# Altium project Smart-Aquarium.PrjPcb
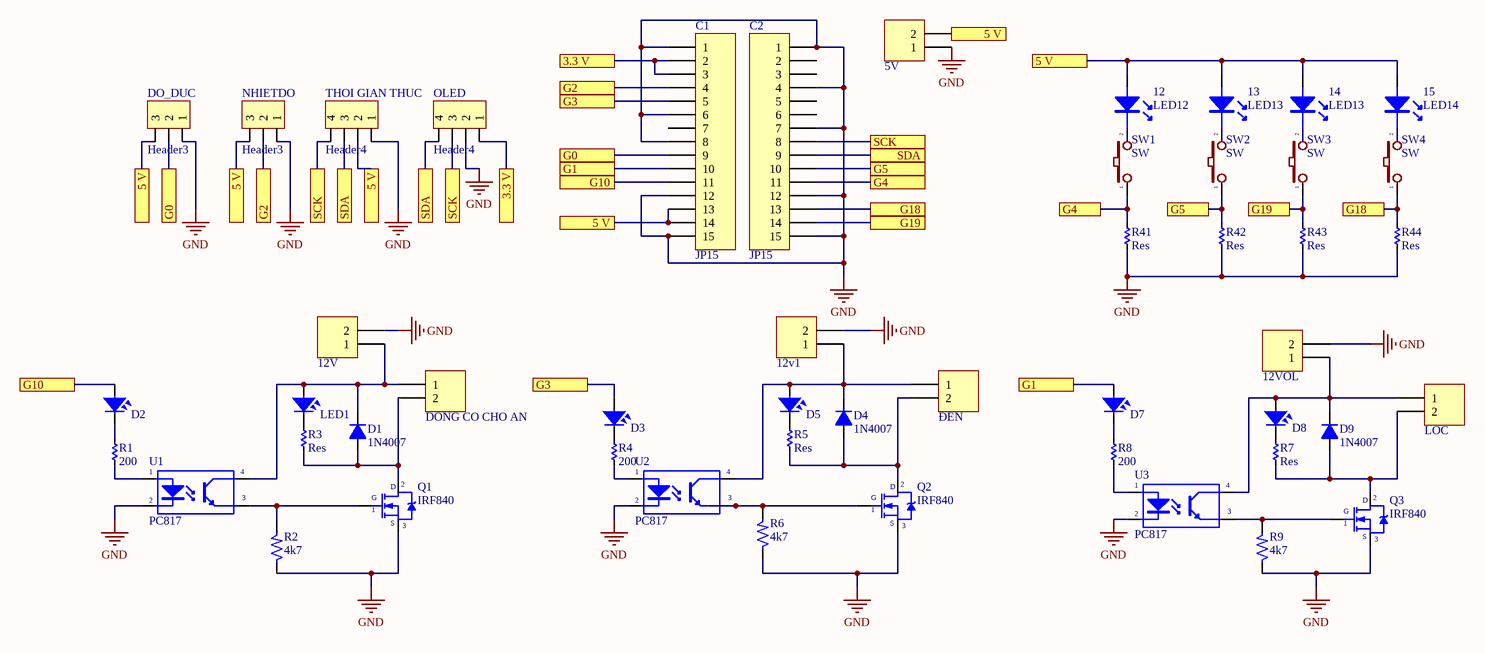
[diagram p0: Sheet2.SchDoc]
1 sheet, 49 parts. Net scope: flat (ports and power ports of the same name join across sheets).
Board file: PCB1.PcbDoc

## Sheet Sheet2.SchDoc
size A1; SheetNumber: 1; SheetTotal: 1

### Parts
5V  Header 2_1  [HED2]  (value not drawn)
12  LED12  [CAP10UF]
12V  Header 2_1  [HED2]  (value not drawn)
12v1  Header 2_1  [HED2]  (value not drawn)
12VOL  Header 2_1  [HED2]  (value not drawn)
13  LED13  [CAP10UF]
14  LED13  [CAP10UF]
15  LED14  [CAP10UF]
C1  JP15  [JP15-C1T]
C2  JP15  [JP15-C1T]
D1  1N4007  [D1A]
D2  LED  [LED-3]  (value not drawn)
D3  LED  [LED-3]  (value not drawn)
D4  1N4007  [D1A]
D5  LED  [LED-3MM-YELLOW]  (value not drawn)
D7  LED  [LED-3]  (value not drawn)
D8  LED  [LED-3MM-YELLOW]  (value not drawn)
D9  1N4007  [D1A]
DO_DUC  Header3  [Header3]
DONG_CO_CHO_AN  Header 2_1  [HED2]  (value not drawn)
LED1  LED  [LED-3MM-YELLOW]  (value not drawn)
LOC  Header 2_1  [HED2]  (value not drawn)
NHIETDO  Header3  [Header3]
OLED  Header4  [Header4]
Q1  IRF840  [TO220H1]
Q2  IRF840  [TO220H1]
Q3  IRF840  [TO220H1]
R1  200  [RES-1/2W]
R2  4k7  [DIEN TRO 1/4 W]
R3  Res  [RES-1/2W]
R4  200  [RES-1/2W]
R5  Res  [RES-1/2W]
R6  4k7  [DIEN TRO 1/4 W]
R7  Res  [RES-1/2W]
R8  200  [RES-1/2W]
R9  4k7  [DIEN TRO 1/4 W]
R41  Res  [RES-1/2W]
R42  Res  [RES-1/2W]
R43  Res  [RES-1/2W]
R44  Res  [RES-1/2W]
SW1  SW  [SW2]
SW2  SW  [SW2]
SW3  SW  [SW2]
SW4  SW  [SW2]
THOI_GIAN_THUC  Header4  [Header4]
U1  PC817  [DIP4]
U2  PC817  [DIP4]
U3  PC817  [DIP4]
ĐEN  Header 2_1  [HED2]  (value not drawn)

### Ports
3.3 V, 5 V, G0, G1, G2, G3, G4, G5, G10, G18, G19, SCK, SDA

### Nets
GND: 5V.1 12V.2 12v1.2 12VOL.2 C1.1 C1.6 C1.8 C1.12 C1.15 C2.1 C2.4 C2.7 C2.12 C2.15 DO_DUC.1 NHIETDO.1 OLED.2 Q1.3(S) Q2.3(S) Q3.3(S) R2.1 R6.1 R9.1 R41.2 R42.2 R43.2 R44.2 THOI_GIAN_THUC.1 U1.2(K) U2.2(K) U3.2(K)
Net5V_2: 5V.2 12.1 13.1 14.1 15.1 C1.13 C1.14 DO_DUC.3 NHIETDO.3 THOI_GIAN_THUC.2 ; port 5 V
Net12_2: 12.2 SW1.2
Net12v1_1: 12v1.1 D4.2(K) D5.1 U2.4(C) ĐEN.1
Net12V_1: 12V.1 D1.2(K) DONG_CO_CHO_AN.1 LED1.1 U1.4(C)
Net12VOL_1: 12VOL.1 D8.1 D9.2(K) LOC.1 U3.4(C)
Net13_2: 13.2 SW2.2
Net14_2: 14.2 SW3.2
Net15_2: 15.2 SW4.2
NetC1_2: C1.2 C1.3 OLED.1 ; port 3.3 V
NetC1_4: C1.4 NHIETDO.2 ; port G2
NetC1_5: C1.5 D3.1 ; port G3
NetC1_9: C1.9 DO_DUC.2 ; port G0
NetC1_10: C1.10 D7.1 ; port G1
NetC1_11: C1.11 D2.1 ; port G10
NetC2_8: C2.8 OLED.3 THOI_GIAN_THUC.4 ; port SCK
NetC2_9: C2.9 OLED.4 THOI_GIAN_THUC.3 ; port SDA
NetC2_10: C2.10 R42.1 SW2.1 ; port G5
NetC2_11: C2.11 R41.1 SW1.1 ; port G4
NetC2_13: C2.13 R44.1 SW4.1 ; port G18
NetC2_14: C2.14 R43.1 SW3.1 ; port G19
NetD1_1: D1.1(A) DONG_CO_CHO_AN.2 Q1.2(D) R3.2
NetD2_2: D2.2 R1.1
NetD3_2: D3.2 R4.1
NetD4_1: D4.1(A) Q2.2(D) R5.2 ĐEN.2
NetD5_2: D5.2 R5.1
NetD7_2: D7.2 R8.1
NetD8_2: D8.2 R7.1
NetD9_1: D9.1(A) LOC.2 Q3.2(D) R7.2
NetLED1_2: LED1.2 R3.1
NetQ1_1: Q1.1(G) R2.2 U1.3(E)
NetQ2_1: Q2.1(G) R6.2 U2.3(E)
NetQ3_1: Q3.1(G) R9.2 U3.3(E)
NetR1_2: R1.2 U1.1(A)
NetR4_2: R4.2 U2.1(A)
NetR8_2: R8.2 U3.1(A)

Not connected (* = marked no-connect by the designer): C1 7; C2 2 3 5 6

### Notes on the sheet
- Title
- Size:
- Date:
- File:
- A1
- Number:
- Time:
- Revision:
- Sheet
- of

### Library data of the parts
5V 12V 12v1 12VOL DONG_CO_CHO_AN LOC ĐEN = Header 2_1: Header, 2-Pin; Manufacturer: Generic Components; Class: Connector; Value: Header 2
12-15 = LED
C1 C2 = JP15: WR-PHD 2.54 mm Angled Socket Header; Manufacturer: W¨¹rth Elektronik eiSos GmbH; partNo: 613015143121; ComponentLink1 Description: Manufacturer; ComponentLink2 Description: Datasheet; NoPins: 15; Created Date: 29 March 2013; ComponentLink1URL: http://www.we-online.com; ComponentLink2URL: http://katalog.we-online.de/em/datasheet/6130xx143121.pdf; Created by: Karrer Zheng
D1 D4 D9 = D1A: Diode 1A; Value: 1N4007
D2 D3 D5 D7 D8 LED1 = LED: LED Single colour Green and Red; Value: LED 3 ly Single Colour
DO_DUC NHIETDO = Header3: Header IDC, 3 x 1 Pin Vertical 2.54mm Pitch (Non-Boxed, Male); Manufacturer: W¨¹rth Elektronik eiSos GmbH; partNo: 613002143121; ComponentLink1 Description: Manufacturer; ComponentLink2 Description: Datasheet; NoPins: 02; Created Date: 29 March 2013; ComponentLink1URL: http://www.we-online.com; ComponentLink2URL: http://katalog.we-online.de/em/datasheet/6130xx143121.pdf; Created by: Karrer Zheng
OLED THOI_GIAN_THUC = Header4: Header IDC, 4 x 1 Pin Vertical 2.54mm Pitch (Non-Boxed, Male); Manufacturer: W¨¹rth Elektronik eiSos GmbH; partNo: 613002143121; ComponentLink1 Description: Manufacturer; ComponentLink2 Description: Datasheet; NoPins: 02; Created Date: 29 March 2013; ComponentLink1URL: http://www.we-online.com; ComponentLink2URL: http://katalog.we-online.de/em/datasheet/6130xx143121.pdf; Created by: Karrer Zheng
Q1-Q3 = IRF840: MOSFET N - CHANNEL 500V - 0.75 - 8A - TO-220; Value: IRF840
R1 R3-R5 R7 R8 R41-R44 = Res: Manufacturer: Generic Components; Class: Passive; SubClass: R; Published: 08/06/2000; Publisher: Altium Hobart Technology Centre
R2 R6 R9 = Res: Resistor 1/4W; Value: R1/4W - 1K
SW1-SW4 = SW2: Switch button 2 pin; Value: SW chip 2 pin
U1-U3 = PC817: Single Opto; Value: PC817